# EasyEDA Pro project ProProject_485接口闭环步进电机控制器_V11_2025-04-04.epro, board PCB1
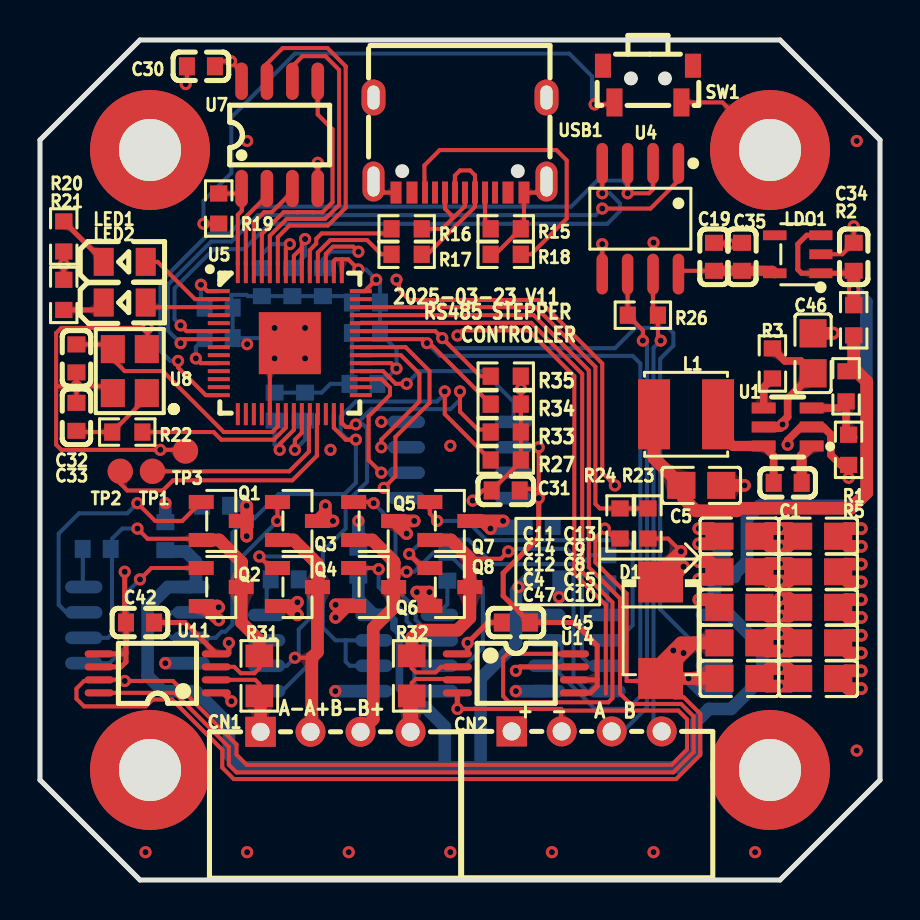
[diagram p1: board, top side]
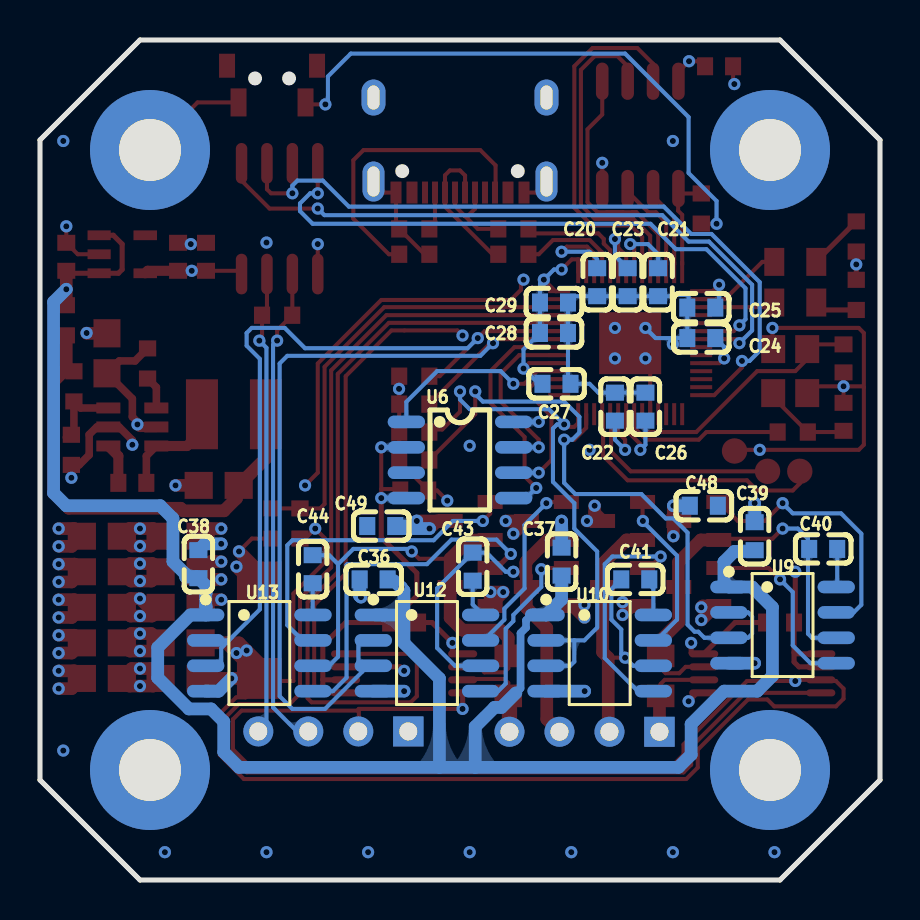
[diagram p2: board, bottom side, seen from below]

Outline 42 x 42 mm; copper layers: Top Layer, Inner1, Inner2, Bottom Layer. Coordinates in mm from the lower left corner of the outline.
Outline path: 0,37 0,5 5,0 37,0 42,5 42,37 37,42 5,42 0,37
Stack: Top Layer 0.035mm 外层铜厚1oz / Dielectric1 0.2104mm 7628 RC49% 8.6mil / Inner1 0.0152mm 内层铜厚 / Dielectric2 1.065mm 1.1mm H/HOZ 含铜 / Inner2 0.0152mm 内层铜厚 / Dielectric3 0.2104mm 7628 RC49% 8.6mil / Bottom Layer 0.035mm 外层铜厚1oz

## Design rules (mm)
template: 自定义配置
spacing copperThickness1oz (default): track to track 0.127, other pairs 0.152 to 0.3
spacing copperThickness2oz: track to track 0.203, other pairs 0.152 to 0.3
track width copperThickness1oz (default): min 0.127, default 0.254, max 2.54
track width copperThickness2oz: min 0.203, default 0.254, max 2.54
differential pair differentialPair (default): width min 0.127, default 0.254, max 2.54; gap min 0.152, default 0.152
via viaSize (default): diameter min 0.5, default 0.61, max 10; hole min 0.3, default 0.305, max 6.299
net GND uses copperRegion_AB
net A+ uses copperRegion_AB
net A- uses copperRegion_AB
net B- uses copperRegion_AB
net B+ uses copperRegion_AB
net A-- uses copperRegion_AB
pour e50 uses copperRegion_AB

## Placement (name value [footprint] x y rotation side)
C1  470nF  [C0603]  37.38 19.86 180 top
C4  22uF  [C0805]  34.97 11.86 0 top
C5  22uF  [C0805]  33.06 19.73 180 top
C8  22uF  [C0805]  38.91 13.63 180 top
C9  22uF  [C0805]  38.91 15.41 180 top
C10  22uF  [C0805]  38.91 10.08 180 top
C11  22uF  [C0805]  34.97 17.19 0 top
C12  22uF  [C0805]  34.97 13.63 0 top
C13  22uF  [C0805]  38.91 17.19 180 top
C14  22uF  [C0805]  34.97 15.41 0 top
C15  22uF  [C0805]  38.91 11.86 180 top
C19  100nF  [C0603]  33.7 31.16 90 top
C20  1uF  [C0603]  14.14 29.89 90 bottom
C21  100nF  [C0603]  11.09 29.89 90 bottom
C22  100nF  [C0603]  13.25 23.67 270 bottom
C23  100nF  [C0603]  12.62 29.89 90 bottom
C24  100nF  [C0603]  8.94 27.1 180 bottom
C25  100nF  [C0603]  8.94 28.62 180 bottom
C26  100nF  [C0603]  11.73 23.67 270 bottom
C27  100nF  [C0603]  16.17 24.81 0 bottom
C28  100nF  [C0603]  16.3 27.35 0 bottom
C29  1uF  [C0603]  16.3 28.87 0 bottom
C30  100nF  [C0603]  8.05 40.69 0 top
C31  100nF  [C0603]  23.29 19.48 180 top
C32  12pF  [C0603]  1.82 26.08 90 top
C33  12pF  [C0603]  1.82 23.16 270 top
C34  1uF  [C0603]  40.69 31.16 270 top
C35  1uF  [C0603]  35.1 31.16 270 top
C36  100nF  [C0603]  25.32 15.03 180 bottom
C37  100nF  [C0603]  15.92 15.92 270 bottom
C38  100nF  [C0603]  34.08 15.79 270 bottom
C39  100nF  [C0603]  6.27 17.19 270 bottom
C40  1uF  [C0603]  2.84 16.56 180 bottom
C41  1uF  [C0603]  12.24 15.03 180 bottom
C42  100nF  [C0603]  5 12.87 180 top
C43  1uF  [C0603]  20.37 15.67 270 bottom
C44  1uF  [C0603]  28.37 15.54 270 bottom
C45  100nF  [C0603]  23.79 12.87 0 top
C46  22uF  [C0805]  38.65 26.33 270 top
C47  22uF  [C0805]  34.97 10.08 0 top
C48  100nF  [C0603]  8.81 18.71 0 bottom
C49  100nF  [C0603]  24.94 17.7 180 bottom
CN1  ZX-XH2.54-4PWZ  [conn-th_4p-p2.50_zx-xh2.54-4pwz]  14.78 7.41 0 top
CN2  ZX-XH2.54-4PWZ  [CONN-TH_4P-P2.50_ZX-XH2.54-4PWZ]  27.34 7.43 0 top
D1  SMBJ30A  [SMB_L4.6-W3.6-LS5.4-RD]  31.03 12.49 270 top
L1  22uH  [IND-SMD_L4.0-W4.0]  32.3 23.29 180 top
LDO1  ME6211C33M5G-N  [SOT-23-5_L3.0-W1.7-P0.95-LS2.8-BL]  37.89 31.29 90 top
LED1  NCD0805R1  [LED0805-R-RD]  4.24 30.91 0 top
LED2  NCD0805R1  [LED0805-R-RD]  4.24 28.87 0 top
NOREF  -  [Pad_e105]  36.5 36.5 0 top
NOREF#2  -  [Pad_e104]  5.5 36.5 0 top
NOREF#3  -  [Pad_e108]  36.5 5.5 0 top
NOREF#4  -  [Pad_e107]  5.5 5.5 0 top
Q1  SI2318A  [SOT-23-3_L2.9-W1.3-P1.90-LS2.4-BR]  9.06 17.95 180 top
Q2  SI2318A  [SOT-23-3_L2.9-W1.3-P1.90-LS2.4-BR]  9.06 14.65 180 top
Q3  SI2318A  [SOT-23-3_L2.9-W1.3-P1.90-LS2.4-BR]  12.87 17.95 180 top
Q4  SI2318A  [SOT-23-3_L2.9-W1.3-P1.90-LS2.4-BR]  12.87 14.65 180 top
Q5  SI2318A  [SOT-23-3_L2.9-W1.3-P1.90-LS2.4-BR]  16.68 17.95 180 top
Q6  SI2318A  [SOT-23-3_L2.9-W1.3-P1.90-LS2.4-BR]  16.68 14.65 180 top
Q7  SI2318A  [SOT-23-3_L2.9-W1.3-P1.90-LS2.4-BR]  20.49 17.95 180 top
Q8  SI2318A  [SOT-23-3_L2.9-W1.3-P1.90-LS2.4-BR]  20.49 14.65 180 top
R1  43kΩ  [R0603]  40.3 24.68 90 top
R2  0Ω  [R0603]  40.69 27.98 90 top
R3  10kΩ  [R0603]  36.62 25.83 90 top
R5  8.2kΩ  [R0603]  40.43 21.51 90 top
R15  5.1kΩ  [R0603]  23.29 32.56 180 top
R16  27Ω  [R0603]  18.33 32.56 0 top
R17  27Ω  [R0603]  18.33 31.29 0 top
R18  5.1kΩ  [R0603]  23.29 31.29 0 top
R19  1k  [R0603]  8.94 33.57 90 top
R20  5.1kΩ  [R0603]  1.19 32.18 270 top
R21  5.1kΩ  [R0603]  1.19 29.25 90 top
R22  1k  [R0603]  4.36 22.4 0 top
R23  47kΩ  [R0603]  30.4 17.83 270 top
R24  5.1kΩ  [R0603]  29 17.83 90 top
R26  120Ω  [R0603]  30.14 28.24 0 top
R27  2.2kΩ  [R0603]  23.29 21 180 top
R31  10mΩ  [R0805]  10.97 10.2 270 top
R32  10mΩ  [R0805]  18.59 10.2 270 top
R33  2.2kΩ  [R0603]  23.29 22.4 180 top
R34  2.2kΩ  [R0603]  23.29 23.79 180 top
R35  2.2kΩ  [R0603]  23.29 25.19 180 top
SW1  TS24CA 250gf 013  [SW-SMD_L4.7-W3.5-P3.35-EH]  30.4 39.8 0 top
TP1  -  [tp]  5.62 20.43 0 top
TP2  -  [tp]  4.01 20.43 0 top
TP3  -  [tp]  7.27 21.45 90 top
U1  SGM61410XN6G/TR  [TSOT-23-6_L2.9-W1.6-P0.95-LS2.8-BL]  37.38 22.65 90 top
U4  SP3485EEN(UMW)  [SOP-8_L5.0-W4.0-P1.27-LS6.0-BL]  30.02 33.06 180 top
U5  RP2040  [LQFN-56_L7.0-W7.0-P0.4-EP]  12.49 26.84 0 top
U6  MT6816CT-STD  [SOP-8_L4.9-W3.9-P1.27-LS6.0-BL]  21 21 270 bottom
U7  W25Q16JVSNIQ  [SOP-8_L4.9-W3.9-P1.27-LS6.0-BL]  11.98 37.26 0 top
U8  12MHz  [CRYSTAL-SMD_4P-L3.2-W2.5-BL_SIT8008BI]  4.49 25.44 90 top
U9  EG3013S  [SOP-8_L4.9-W3.9-P1.27-LS6.0-BL-1]  4.87 12.75 270 bottom
U10  EG3013S  [SOP-8_L4.9-W3.9-P1.27-LS6.0-BL-1]  14.01 11.35 270 bottom
U11  INA240A2PWR  [TSSOP-8_L4.4-W3.0-P0.65-LS6.4-BL]  5.89 10.33 90 top
U12  EG3013S  [SOP-8_L4.9-W3.9-P1.27-LS6.0-BL-1]  22.65 11.35 270 bottom
U13  EG3013S  [SOP-8_L4.9-W3.9-P1.27-LS6.0-BL-1]  31.03 11.35 270 bottom
U14  INA240A2PWR  [TSSOP-8_L4.4-W3.0-P0.65-LS6.4-BL]  23.79 10.33 270 top
USB1  TYPE-C 16PIN 2MD(073)  [USB-C-SMD_TYPE-C-6PIN-2MD-073]  21 36.75 180 top

## Footprints (pads in the part's own frame, mm; a bottom-side part is the same pattern mirrored in y, then rotated)
C0603
  rect 0.8x0.9 smd: 1(-0.7,0) 2(0.7,0)
C0805
  rect 1.41x1.35 smd: 1(-1,0) 2(1,0)
conn-th_4p-p2.50_zx-xh2.54-4pwz
  rect 1.524x1.5 hole 0.9: 1(-3.75,0)
  round 1.5 hole 0.9: 2(-1.25,0) 3(1.25,0) 4(3.75,0)
CONN-TH_4P-P2.50_ZX-XH2.54-4PWZ
  rect 1.524x1.5 hole 0.9: 1(-3.75,0)
  round 1.5 hole 0.9: 2(-1.25,0) 3(1.25,0) 4(3.75,0)
CRYSTAL-SMD_4P-L3.2-W2.5-BL_SIT8008BI
  rect 1.4x1.2 smd: 1(-1.1,-0.85) 2(1.1,-0.85) 3(1.1,0.85) 4(-1.1,0.85)
IND-SMD_L4.0-W4.0
  rect 1.6x3.5 smd: 1(-1.6,0) 2(1.6,0)
LED0805-R-RD
  rect 1x1.399 smd: 1(1.05,0) 2(-1.05,0)
LQFN-56_L7.0-W7.0-P0.4-EP
  rect 1.1x0.2 smd: 1(-3.55,2.6) 2(-3.55,2.2) 3(-3.55,1.8) 4(-3.55,1.4) 5(-3.55,1) 6(-3.55,0.6) 7(-3.55,0.2) 8(-3.55,-0.2) 9(-3.55,-0.6) 10(-3.55,-1) 11(-3.55,-1.4) 12(-3.55,-1.8) 13(-3.55,-2.2) 14(-3.55,-2.6) 29(3.55,-2.6) 30(3.55,-2.2) 31(3.55,-1.8) 32(3.55,-1.4) 33(3.55,-1) 34(3.55,-0.6) 35(3.55,-0.2) 36(3.55,0.2) 37(3.55,0.6) 38(3.55,1) 39(3.55,1.4) 40(3.55,1.8) 41(3.55,2.2) 42(3.55,2.6)
  rect 0.2x1.1 smd: 15(-2.6,-3.55) 16(-2.2,-3.55) 17(-1.8,-3.55) 18(-1.4,-3.55) 19(-1,-3.55) 20(-0.6,-3.55) 21(-0.2,-3.55) 22(0.2,-3.55) 23(0.6,-3.55) 24(1,-3.55) 25(1.4,-3.55) 26(1.8,-3.55) 27(2.2,-3.55) 28(2.6,-3.55) 43(2.6,3.55) 44(2.2,3.55) 45(1.8,3.55) 46(1.4,3.55) 47(1,3.55) 48(0.6,3.55) 49(0.2,3.55) 50(-0.2,3.55) 51(-0.6,3.55) 52(-1,3.55) 53(-1.4,3.55) 54(-1.8,3.55) 55(-2.2,3.55) 56(-2.6,3.55)
  rect 3.1x3.1 smd: 57(0,0)
Pad_e104
  round 6 hole 3.1: 58(0,0)
Pad_e105
  round 6 hole 3.1: 59(0,0)
Pad_e107
  round 6 hole 3.1: 60(0,0)
Pad_e108
  round 6 hole 3.1: 61(0,0)
R0603
  rect 0.806x0.864 smd: 1(-0.753,0) 2(0.753,0)
R0805
  rect 1.133x1.377 smd: 1(-1,0) 2(1,0)
SMB_L4.6-W3.6-LS5.4-RD
  rect 2.047x2.241 smd: 1(-2.413,0) 2(2.413,0)
SOP-8_L4.9-W3.9-P1.27-LS6.0-BL
  oval 0.63x1.865 smd: 1(-1.905,-2.683) 2(-0.635,-2.683) 3(0.635,-2.683) 4(1.905,-2.683) 5(1.905,2.683) 6(0.635,2.683) 7(-0.635,2.683) 8(-1.905,2.683)
SOP-8_L4.9-W3.9-P1.27-LS6.0-BL-1
  oval 0.63x1.865 smd: 1(-1.905,-2.683) 2(-0.635,-2.683) 3(0.635,-2.683) 4(1.905,-2.683) 5(1.905,2.683) 6(0.635,2.683) 7(-0.635,2.683) 8(-1.905,2.683)
SOP-8_L5.0-W4.0-P1.27-LS6.0-BL
  oval 0.574x2.035 smd: 1(-1.905,-2.768) 2(-0.635,-2.768) 3(0.635,-2.768) 4(1.905,-2.768) 5(1.905,2.768) 6(0.635,2.768) 7(-0.635,2.768) 8(-1.905,2.768)
SOT-23-3_L2.9-W1.3-P1.90-LS2.4-BR
  rect 1.25x0.7 smd: 1(1,-0.95) 2(1,0.95) 3(-1,0)
SOT-23-5_L3.0-W1.7-P0.95-LS2.8-BL
  rect 0.49x1.157 smd: 1(-0.95,-1.153) 2(0,-1.153) 3(0.95,-1.153)
  rect 0.49x1.175 smd: 4(0.95,1.153) 5(-0.95,1.153)
SW-SMD_L4.7-W3.5-P3.35-EH
  rect 0.8x1.4 smd: 1(-1.675,-0.917) 2(1.675,-0.917)
  rect 0.8x1.2 smd: 3(-2.25,0.917) 4(2.25,0.917)
tp
  round 1.27 smd: 1(0,0)
TSOT-23-6_L2.9-W1.6-P0.95-LS2.8-BL
  rect 0.55x1.2 smd: 1(-0.95,-1.2) 2(0,-1.2) 3(0.95,-1.2) 4(0.95,1.2) 5(0,1.2) 6(-0.95,1.2)
TSSOP-8_L4.4-W3.0-P0.65-LS6.4-BL
  oval 0.353x1.454 smd: 1(-0.975,-2.927) 2(-0.325,-2.927) 3(0.325,-2.927) 4(0.975,-2.927) 5(0.975,2.927) 6(0.325,2.927) 7(-0.325,2.927) 8(-0.975,2.927)
USB-C-SMD_TYPE-C-6PIN-2MD-073
  rect 0.55x1.1 smd: 1(-3.2,2.375) 2(-2.4,2.375) 11(2.4,2.375) 12(3.2,2.375)
  rect 0.3x1.1 smd: 3(-1.75,2.375) 4(-1.25,2.375) 5(-0.75,2.375) 6(-0.25,2.375) 7(0.25,2.375) 8(0.75,2.375) 9(1.25,2.375) 10(1.75,2.375)
  oval 1.1x2 hole 0.6x1.5: 13(-4.325,1.825) 14(4.325,1.825)
  oval 1.2x1.8 hole 0.6x1.2: 13(-4.325,-2.375) 14(4.325,-2.375)

## Nets
As in the schematic, except:
GND: C4.1 C5.1 C8.1 C9.1 C10.1 C11.1 C12.1 C13.1 C14.1 C15.1 C19.2 C20.1 C21.1 C22.1 C23.1 C24.1 C25.1 C26.1 C27.1 C28.1 C29.1 C30.1 C31.2 C32.1 C33.1 C34.1 C35.1 C36.1 C37.1 C38.1 C39.1 C42.1 C45.1 C46.1 C47.1 C48.1 C49.1 CN2.2 D1.2 LDO1.2 NOREF.59 NOREF#2.58 NOREF#3.61 NOREF#4.60 Q2.2 Q4.2 Q6.2 Q8.2 R5.1 R15.1 R18.1 R20.2 R21.2 R24.1 R27.1 R33.1 R34.1 R35.1 SW1.2 TP3.1 U1.2 U4.5 U5.19 U5.57 U6.8 U7.4 U8.2 U8.4 U9.4 U10.4 U11.1 U11.4 U11.7 U12.4 U13.4 U14.1 U14.4 U14.7 USB1.1 USB1.12 USB1.13 USB1.14

Pads without a net: LDO1 4; SW1 3 4; U5 4 5 8 9 11 12 13 15 16 17 18 26 29 30 41; U6 3; USB1 2 3 9 11

## Via types
v1: diameter 0.61, hole 0.305, Top Layer to Bottom Layer, 146 vias

## Routing (per net, layer and track width the routed paths; a pad name or vN(x,y) marks a point on that pad's centre or on a via; arc(x,y) is an arc through that point)
5V: length 103.9
  Top Layer w0.254: C34.2 40.56,30.34 LDO1.1 38.08,30.34 37.89,30.53 37.89,31.8 38.33,32.24 39.04,32.24
  Top Layer w0.635: C34.2 v1(40.69,29.54) R2.2
  Bottom Layer w0.381: 17.43,13.25 17.7,12.99 17.7,12.62 17.97,12.34 17.97,9.58 18.21,9.35
  Bottom Layer w0.635: U13.1 33.7,13.27 33.7,13.68 33.71,13.69 33.71,14.34 33.7,14.35 33.7,14.71 C38.2 34.15,15.16 34.72,15.16 34.72,15.28 35.35,15.92 35.35,18.08 35.99,18.71 40.69,18.71 41.32,19.35 41.32,28.9 v1(40.69,29.54) ; U13.1 33.59,13.25 ; U13.1 34.48,13.25 36.11,11.62 36.11,10.11 34.55,8.55 33.45,8.55 32.81,7.92 32.81,6.39 32.05,5.63 22.03,5.63 ; 17.43,13.25 U10.1 15.92,14.03 C37.2 ; 6.27,16.43 7.28,16.43 7.8,15.91 7.8,14.9 U9.1 6.4,14.65 5.38,13.63 5.38,10.2 6.14,9.44 7.79,9.44 9.44,7.79 9.44,6.27 10.08,5.63 20.24,5.63 ; 23.8,13.19 23.8,14.47 24.3,14.97 ; 23.8,13.19 23.8,11.85 22.03,10.08 22.03,5.63 ; 23.8,13.19 23.87,13.25 25.21,13.25 ; 22.03,5.63 20.24,5.63 ; 20.24,5.63 20.24,7.67 19.27,8.63 18.93,8.63 18.21,9.35
  vias: v1(23.92,14.65)
5V_DCDC: length 22.7
  Top Layer w0.635: L1.2 30.7,21.09 C5.2 32.18,19.62 32.18,19.08 32.8,18.46 34.84,18.46 34.97,18.59 40.56,18.59 41.33,19.36 41.33,24.92 40.69,25.57 R2.1
24V: length 46.8
  Top Layer w0.203: R23.2 31.41,17.07 v1(32.05,16.43)
  Top Layer w0.381: v1(37.13,22.78) 37.13,22.91 37.38,23.16 37.38,24.06 C46.2 38.03,25.95 37.25,25.95 R3.2
  Top Layer w0.508: U1.5 37,22.65 v1(37.13,22.78)
  Top Layer w0.635: v1(18.71,17.95) Q5.3 17.7,17.95 v1(18.33,17.32) ; 30.78,14.9 31.41,14.9 v1(32.18,15.67) ; 30.78,14.9 30.53,14.9 ; 30.78,14.9 30.78,15.16 v1(32.05,16.43) ; v1(10.33,18.71) v1(10.33,17.19) ; v1(23.16,17.95) 22.14,17.95 ; 22.14,17.95 v1(22.52,17.57) ; 22.14,17.95 Q7.3 ; v1(14.27,18.71) 14.27,18.35 Q3.3 v1(14.65,17.95) ; 37.41,10.57 C10.2 37.53,9.7 v1(37,9.7) 36.35,9.7 C47.2 36.46,10.57 v1(37,10.57) 37.41,10.57 ; v1(37,16.7) 36.46,16.7 C11.2 36.35,17.57 v1(37,17.57) 37.53,17.57 C13.2 37.41,16.7 v1(37,16.7) ; 37.44,14.95 C9.2 37.5,15.82 v1(37,15.82) 36.38,15.82 C14.2 36.44,14.95 v1(37,14.95) 37.44,14.95 ; 37.47,14.07 C8.2 37.47,13.2 v1(37,13.2) 36.41,13.2 C12.2 36.56,13.63 v1(37,14.07) 37.47,14.07 ; v1(37,12.32) 37.44,12.32 C15.2 37.5,11.45 v1(37,11.45) 36.38,11.45 C4.2 36.44,12.32 v1(37,12.32)
  Bottom Layer w0.635: v1(22.52,17.57) 24.11,17.57 24.24,17.7 23.41,17.7 v1(23.16,17.95) ; v1(10.33,18.71) C48.2
GND: length 284.1
  Top Layer w0.203: C30.1 7.35,39.86 v1(7.28,39.8) ; 1.82,24.68 0.85,24.68 0.81,24.64 ; 0.81,24.64 0.81,21.76 1.06,21.51 v1(6.01,21.51) 6.71,21.51 7.15,21.07 ; 0.81,24.64 0.81,27.35 1.06,27.6 v1(5.38,27.6) 5.38,26.58 U8.2 ; v1(20.87,27.22) 21.13,27.48 24.43,27.48 26.72,25.19 26.72,15.32 28.29,13.75 28.29,9.32 ; R18.1 22.77,31.29 R15.1 24.2,32.72 USB1.1 24.78,34.37 USB1.13 ; v1(1.82,24.68) 3.3,24.68 U8.4 ; v1(1.82,24.68) C33.1 ; v1(1.82,24.68) C32.1 ; C19.2 C35.1 ; v1(13.89,35.86) U7.4 ; 26.06,8.55 v1(20.87,8.55) ; 26.06,8.55 26.06,7.46 CN2.2 ; 26.06,8.55 26.14,8.47 31.92,8.47 32.35,8.04 32.35,6.53 31.58,5.76 10.33,5.76 9.82,6.27 9.82,6.78 6.65,9.95 v1(4.24,9.95) 4.18,10.01 2.96,10.01 2.9,9.95 2.2,9.95 1.82,9.57 1.82,9.06 2.2,8.68 5.29,8.68 5.63,9.03 6.6,9.03 9.11,6.51 9.11,5.62 9.69,5.05 31.81,5.05 33.01,6.26 33.01,8.31 32.19,9.13 31.73,9.13 30.91,9.95 ; 30.91,9.95 D1.2 ; 30.91,9.95 29.33,9.95 29.33,14.32 27.77,15.88 27.77,17.1 v1(28.24,17.57) 28.74,17.07 R24.1 ; LDO1.2 40.11,31.29 C34.1 v1(40.69,32.68) ; U5.57 v1(11.73,26.08) 11.49,25.84 U5.19 ; v1(28.75,19.73) 28.11,20.36 28.11,25.83 24.94,29 18.46,29 17.95,29.51 17.95,29.89 v1(17.82,30.02) ; R35.1 24.05,25.18 v1(24.05,24.56) 24.05,23.8 R34.1 R33.1 R27.1 24.04,20.93 C31.2 22.14,19.48 v1(21.63,18.97) ; SW1.2 34.12,38.88 NOREF.59 ; USB1.14 17.22,34.37 USB1.12 ; U4.5 v1(28.11,31.8)
  Top Layer w0.254: C42.1 7.25,12.87 8.81,11.31 9.4,11.31 9.44,11.35 v1(9.44,11.86) ; C45.1 22.4,12.87 v1(21.38,11.86) 21.38,11.31 20.87,11.31 ; v1(23.79,10.46) 23.99,10.66 U14.7 ; U11.1 9.15,9.36 v1(9.57,8.94) ; v1(20.87,8.55) 20.87,8.56 U14.4 ; R20.2 v1(1.19,30.78) R21.2
  Top Layer w0.381: v1(40.43,20.11) R5.1 40.04,20.75 39.54,21.25 39.54,22.27 39.16,22.65 U1.2 38.04,22.65 37.38,21.99 v1(37.38,21.76)
  Top Layer w0.635: v1(32.94,17.57) 33.59,17.57 C11.1 33.59,16.81 v1(32.94,16.81) ; v1(41.07,14.9) 40.41,14.9 C9.1 40.29,15.79 v1(41.07,15.79) ; 32.68,11.86 32.05,11.86 v1(31.67,11.47) 30.53,10.33 30.53,10.08 30.91,10.08 v1(32.18,11.35) 32.68,11.86 ; 32.68,11.86 C4.1 ; v1(14.78,13.76) 15.62,13.76 Q6.2 15.35,13.7 v1(14.78,13.13) ; v1(32.94,14.02) 33.59,14.02 C12.1 ; v1(8.94,13) 8.23,13.7 ; 8.23,13.7 8.87,13.7 v1(8.94,13.63) ; 8.23,13.7 Q2.2 ; 19.49,13.75 v1(18.84,14.4) v1(19.48,14.4) 19.49,14.38 19.49,13.75 ; 19.49,13.75 Q8.2 ; v1(41.07,11.35) 40.41,11.35 C15.1 40.29,12.24 v1(41.07,12.24) ; 12.43,13.7 12.68,13.7 v1(12.87,13.89) ; 12.43,13.7 Q4.2 ; 12.43,13.7 v1(12.87,13.25) ; v1(41.07,9.57) 40.41,9.57 C10.1 40.29,10.46 v1(41.07,10.46) ; v1(35.22,19.73) C5.1 ; 31.03,9.95 31.16,10.08 v1(32.43,10.08) C47.1 ; v1(32.94,15.03) 33.59,15.03 C14.1 33.46,15.92 v1(32.94,15.92) ; v1(41.07,13.13) 40.41,13.13 C8.1 40.29,14.02 v1(41.07,14.02) ; v1(41.07,17.57) 40.29,17.57 C13.1 40.41,16.68 v1(41.07,16.68) ; v1(39.67,27.35) 39.65,27.33 C46.1
  Bottom Layer w0.203: C26.1 C22.1 14.08,24.37 14.52,24.81 C27.1 15.6,24.94 C28.1 C29.1 15.28,29.19 C20.1 C23.1 C21.1 10.4,29.19 10.33,29.25 9.57,29.25 9.57,28.69 C25.1 C24.1 11.22,27.1 v1(11.73,27.6)
  Bottom Layer w0.254: v1(17.06,22.91) U6.8
  Bottom Layer w0.635: U9.4 v1(6.27,10.84) ; 34.08,16.49 33.76,16.81 v1(32.94,16.81) ; U12.4 v1(23.79,9.44) ; v1(32.43,10.08) 33.06,9.44 U13.4 ; v1(25.95,14.14) 26.02,14.21 C36.1 ; 6.27,18.02 v1(6.27,18.84) ; v1(15.92,17.95) C37.1 ; v1(14.77,9.44) U10.4
  vias: v1(5.28,1.39) v1(10.36,36.95) v1(10.36,26.79) v1(10.36,1.39) v1(13.25,27.6) v1(13.25,26.08) v1(14.52,21.51) v1(15.44,1.39) v1(20.52,21.71) v1(20.52,1.39) v1(25.6,1.39) v1(30.68,31.87) v1(30.68,1.39) v1(34.46,31.8) v1(35.76,1.39) v1(40.84,36.95) v1(40.84,6.47)
VBUS_SNS: length 22.5
  Top Layer w0.203: 16.04,28.64 24.79,28.64 27.77,25.66 27.77,18.8 27.99,18.58 R24.2 R23.1
1P1V: length 12.2
  Top Layer w0.203: v1(15.92,31.41) 15.67,31.67 14.65,31.67 14.29,31.31 U5.45 ; v1(12.75,21.51) 12.75,22.02 13.09,22.36 U5.23 ; v1(12.49,31.8) 12.29,31.59 12.29,30.77
  Bottom Layer w0.203: v1(15.92,31.41) 14.52,31.41 14.14,31.03 C20.2 ; C22.2 13.25,22.02 v1(12.75,21.51) ; v1(12.49,31.8) 11.6,31.8 11.09,31.29 C21.2
3P3V: length 61.5
  Top Layer w0.203: 12.69,30.77 12.69,31.2 13.05,31.56 13.09,31.52 ; 13.09,31.52 13.09,30.77 ; 13.09,31.52 13.09,31.89 v1(13.25,32.05) ; 16.04,29.44 16.23,29.44 v1(16.81,30.02) ; 15.11,31.03 15.41,31.03 v1(15.92,30.53) ; 15.11,31.03 14.78,31.03 14.69,30.95 U5.44 ; 15.11,31.03 15.09,31.01 U5.43 ; C19.1 32.09,30.46 U4.8 ; v1(17.82,25.57) 17.56,25.84 16.04,25.84 ; U5.1 8.37,29.44 v1(8.05,29.76) ; U7.8 10.08,40.41 v1(9.55,40.94) 9.13,40.94 8.75,40.56 ; v1(24.94,21.64) 24.94,19.55 ; 24.94,19.55 24.06,19.55 C31.1 ; 24.94,19.55 v1(24.94,19.09) ; U5.22 12.69,22.5 11.98,21.8 v1(11.98,21.51) ; U5.10 8.03,25.84 v1(7.79,26.08)
  Top Layer w0.254: 4.3,11.38 4.23,11.31 2.96,11.31 ; 4.3,11.38 C42.2 4.24,12.93 v1(4.24,15.41) ; 4.3,11.38 4.3,10.9 4.05,10.66 U11.6 ; 27.86,10.03 27.86,9.7 27.52,9.36 U14.5 ; 27.86,10.03 27.86,11.73 26.72,12.87 C45.2 23.16,14.21 23.16,15.35 24.94,17.13 v1(24.94,19.09) ; 27.86,10.03 27.84,10.01 26.72,10.01
  Top Layer w0.508: LDO1.5 36.61,30.46 C35.2 v1(34.41,30.46) C19.1
  Bottom Layer w0.203: v1(7.79,26.08) 7.79,26.65 C24.2 ; v1(11.98,21.51) 11.73,21.76 C26.2 ; C27.2 17.06,24.81 v1(17.82,25.57) 17.82,26.53 C28.2 C29.2 17,29.83 v1(16.81,30.02) 16.3,30.53 v1(15.92,30.53) ; C23.2 13.25,31.22 v1(13.25,32.05) ; C25.2 8.05,28.81 v1(8.05,29.76)
  Bottom Layer w0.254: v1(24.94,21.64) U6.2 ; U6.4 v1(24.94,19.09)
485_A: length 24.3
  Top Layer w0.203: v1(30.14,26.97) 30.14,27.49 R26.1 29.38,28.25 U4.6
  Bottom Layer w0.203: v1(30.14,26.97) 30.35,26.77 30.35,8.63 29.15,7.43 CN2.3
485_B: length 23.3
  Top Layer w0.203: v1(31.03,26.97) 30.9,27.1 R26.2 30.65,28.48 U4.7
  Bottom Layer w0.203: CN2.4 30.68,7.84 30.68,26.61 v1(31.03,26.97)
485_EN: length 37.6
  Top Layer w0.203: U4.3 v1(29.38,34.33) 30.45,34.33 30.65,34.54 U4.2 ; v1(6.9,25.95) 6.9,25.63 8.29,24.24 U5.14
  Bottom Layer w0.203: v1(6.9,25.95) 6.52,25.95 6.01,26.46 6.01,29.89 8.43,32.3 9.44,32.3 10.81,33.67 26.56,33.67 27.86,34.97 29.13,34.97 29.38,34.72 v1(29.38,34.33)
A1H: length 8.2
  Top Layer w0.203: v1(11.86,17.95) 11.87,17.97 Q3.1
  Bottom Layer w0.203: U10.7 11.18,11.98 10.15,13.02 10.15,16.21 11.83,17.9 v1(11.86,17.95)
A1L: length 11.9
  Top Layer w0.203: Q4.1 11.54,15.6 v1(10.97,16.17)
  Bottom Layer w0.203: U10.5 12.11,9.44 13.76,11.09 13.76,15.79 13.38,16.17 v1(10.97,16.17)
A2H: length 13.5
  Top Layer w0.203: Q1.1 7.11,17.95 5.76,17.95 v1(4.87,18.84)
  Bottom Layer w0.203: v1(4.87,18.84) 4.36,18.33 1.95,18.33 0.93,17.32 0.93,13.76 1.31,13.38 U9.7
A2L: length 10
  Top Layer w0.203: Q2.1 5.57,15.6 v1(5,15.03)
  Bottom Layer w0.203: 1.55,10.84 3.47,10.84 4.36,11.73 4.36,14.4 v1(5,15.03)
A+: length 17.9
  Top Layer w0.203: v1(12.75,11.11) 13.59,11.11
  Top Layer w0.635: Q3.2 12.68,17 13.89,15.79 13.89,14.67 Q4.3 13.87,11.4 13.59,11.11 13.59,7.47 CN1.2
  Bottom Layer w0.203: C41.1 13.43,14.54 13.43,13.02 12.94,12.53 12.94,11.31 v1(12.75,11.11) 12.34,10.71 U10.6
A-: length 4.7
  Top Layer w0.203: 8.81,10.01 10.76,10.01 10.97,9.8 R31.2
  Top Layer w0.635: R31.2 11.03,9.14 CN1.1
A--: length 22.3
  Top Layer w0.203: R31.1 10.97,10.59 10.72,10.34 10.04,10.34 9.72,10.66 U11.3 ; v1(4.87,17.57) 5.38,17.06 8,17.06 Q1.2
  Top Layer w0.635: Q1.2 8.96,17 10.08,15.88 10.08,14.67 Q2.3 10.06,12.89 10.97,11.98 R31.1
  Bottom Layer w0.203: 1.55,12.11 3.4,12.11 3.6,12.31 3.6,17.06 4.11,17.57 v1(4.87,17.57)
B1H: length 17
  Top Layer w0.203: v1(19.86,17.95) 19.49,18.32 Q7.1
  Bottom Layer w0.203: v1(19.86,17.95) 21.35,17.95 22.32,16.99 29.38,16.99 29.64,16.73 29.64,12.75 28.87,11.98 U13.7
B1L: length 17.9
  Top Layer w0.254: v1(18.46,16.3) 19.16,15.6 Q8.1
  Bottom Layer w0.203: v1(18.46,16.3) 19.18,17.02 21.42,17.02 22.65,15.79 26.63,15.79 26.67,15.75 26.67,10.12 27.35,9.44 U13.5
B2H: length 9.2
  Top Layer w0.203: Q5.1 16.62,18.9 v1(16.68,18.84)
  Bottom Layer w0.203: 19.84,11.98 19.82,11.98 18.78,13.02 18.78,13.57 17.77,14.57 17.77,17.75 v1(16.68,18.84)
B2L: length 9.1
  Top Layer w0.203: v1(16.94,15.54) 16.88,15.6 Q6.1
  Bottom Layer w0.203: U12.5 19.09,9.44 18.71,9.82 18.71,12.57 18.33,12.95 18.33,13.25 16.94,14.65 v1(16.94,15.54)
B+: length 4.8
  Top Layer w0.203: R32.2 18.59,9.85 18.79,10.05 20.82,10.05 20.87,10.01
  Top Layer w0.762: R32.2 18.53,9.14 CN1.4
B++: length 26.3
  Top Layer w0.203: R32.1 18.59,10.59 18.79,10.38 19.78,10.38 20.06,10.66 U14.2 ; 21.49,16.06 23.05,16.06 v1(23.41,16.43)
  Top Layer w0.635: R32.1 18.59,12.11 18.97,12.49 20.87,12.49 21.49,13.11 Q8.3 21.49,16.06 20.55,17 Q7.2
  Bottom Layer w0.203: U13.6 27.54,10.71 27.1,11.16 27.1,15.79 ; 27.1,15.79 27.54,16.24 C44.1 ; 27.1,15.79 26.33,16.56 23.54,16.56 v1(23.41,16.43)
B-: length 23
  Top Layer w0.203: v1(18.33,15.41) 17.91,15.41 17.71,15.22
  Top Layer w0.635: Q5.2 16.62,17 17.68,15.94 17.68,15.89 17.71,15.86 17.71,15.22 17.68,15.19 Q6.3 17.68,13.62 16.66,12.6 16.66,8.05 CN1.3
  Bottom Layer w0.203: 19.84,10.71 21.25,10.71 22.14,11.6 22.14,14.59 C43.1 19.67,16.37 18.71,15.41 v1(18.33,15.41)
FCS: length 5.2
  Top Layer w0.203: 9.89,30.77 9.89,33.26 10.09,33.46 10.09,34.56 U7.1 10.08,34.95 ; 9.89,34.33 R19.2
FSCK: length 15.5
  Top Layer w0.203: 12.62,40.32 12.62,40.69 13.13,41.19 14.27,41.19 14.96,40.51 14.96,33.75 14.26,33.06 12.34,33.06 11.49,32.21 11.49,30.77
IO0: length 12.5
  Top Layer w0.203: 11.09,30.77 11.09,32.3 12.19,33.39 12.37,33.39 12.38,33.39 12.85,33.39 12.86,33.39 13.64,33.39 13.65,33.39 14.12,33.39 14.62,33.89 14.62,37.54 13.89,38.27 13.89,40.32
IO1: length 4.6
  Top Layer w0.203: 11.35,34.95 U7.2 11.35,34.21 10.29,33.15 10.29,30.77
IO2: length 5.2
  Top Layer w0.203: 12.62,34.95 U7.3 12.62,34.42 11.58,33.39 11.2,33.39 10.69,32.88 10.69,30.77
IO3: length 18
  Top Layer w0.203: U7.7 11.35,40.81 12.13,41.6 14.37,41.6 15.28,40.69 15.28,33.61 14.4,32.73 12.47,32.73 11.89,32.14 11.89,30.77
IOUT_A: length 67.6
  Top Layer w0.203: U11.8 6.74,9.36 9.44,6.65 9.44,5.76 9.82,5.38 31.67,5.38 32.68,6.39 32.68,8.17 32.06,8.8 29.52,8.8 29,9.32 29,14.07 27.44,15.63 27.44,25.48 24.68,28.24 16.04,28.24
IOUT_B: length 40.2
  Top Layer w0.203: 26.72,11.31 23.37,11.31 23.16,11.09 23.16,9.19 23.46,8.88 28.42,8.88 28.62,9.09 28.62,13.88 27.11,15.39 27.11,25.3 24.56,27.86 16.06,27.86 16.04,27.84
LED1: length 4.4
  Top Layer w0.203: U5.2 7.75,29.04 5.89,30.91 LED1.1
LED2: length 3.8
  Top Layer w0.203: LED2.1 5.52,28.64 U5.3
MT6816_CS: length 9.8
  Top Layer w0.203: v1(18.33,24.81) 17.78,24.81 17.15,25.44 16.04,25.44
  Bottom Layer w0.203: U6.1 23.68,23.91 22.14,25.44 18.97,25.44 v1(18.33,24.81)
MT6816_MISO: length 7.9
  Top Layer w0.203: 16.04,25.04 17.09,25.04 17.5,24.63 17.5,24.25 16.43,23.18 16.43,21 v1(17.06,20.36)
  Bottom Layer w0.203: v1(17.06,20.36) U6.6
MT6816_MOSI: length 12.1
  Top Layer w0.203: 16.04,26.64 18.28,26.64 19.48,25.44 19.48,23.86 17.77,22.15 17.77,20.18 v1(17.19,19.6)
  Bottom Layer w0.203: v1(17.19,19.6) 17.7,19.09 U6.5
MT6816_SCK: length 9
  Top Layer w0.203: v1(17.06,21.64) 17.06,22.02 18.97,23.92 18.97,25.32 18.04,26.24 16.04,26.24
  Bottom Layer w0.203: v1(17.06,21.64) U6.7
PWM_A1: length 27.2
  Top Layer w0.203: 15.8,22.65 15.29,22.65 15.09,22.85 U5.28 ; R33.2 22.41,22.52 21.89,22.52 21,23.41 v1(21,24.43)
  Bottom Layer w0.203: 15.28,11.98 14.78,11.98 14.14,12.62 14.14,16.43 15.28,17.57 15.28,18.84 16.35,19.91 16.35,22.58 16.15,22.78 v1(15.79,22.78) 16.56,23.54 20.52,23.54 21,24.02 v1(21,24.43) ; 15.28,11.98 U10.2 ; 15.28,11.98 15.28,10.92 15.49,10.71 U10.3
PWM_A2: length 33.4
  Top Layer w0.203: v1(20.24,24.43) 20.24,23.29 R27.2 ; U5.27 14.69,22.61 15.28,22.02 v1(15.79,22.02)
  Bottom Layer w0.203: 20.24,24.3 19.86,23.92 15.79,23.92 15.03,23.16 15.03,22.37 15.39,22.02 v1(15.79,22.02) 15.79,19.86 15.23,19.3 11.93,19.3 10.71,18.08 10.33,18.08 9.62,17.37 9.62,12.77 9.27,12.42 9.08,12.42 8.78,12.11 U9.3 6.6,12.11 6.4,12.31 6.4,13.18 6.6,13.38 U9.2
PWM_B1: length 39.3
  Top Layer w0.203: R35.2 22.02,25.19 v1(20.11,27.1) 19.76,27.45 16.07,27.45
  Bottom Layer w0.203: 32.56,11.98 32.94,11.6 32.94,10.84 33.06,10.71 U13.3 ; 32.56,11.98 31.01,13.53 31.01,26.05 31.67,26.72 31.67,27.35 31.41,27.6 29.76,27.6 28.75,26.59 20.62,26.59 v1(20.11,27.1) ; 32.56,11.98 U13.2
PWM_B2: length 43.7
  Top Layer w0.203: 16.04,27.04 19.15,27.04 v1(19.35,26.84) 19.48,26.84 R34.2
  Bottom Layer w0.203: 25.88,10.71 U12.3 ; 25.88,10.71 26.08,10.92 26.08,11.98 U12.2 ; 25.88,10.71 25.88,10.43 27.75,8.55 29.38,8.55 30.02,9.19 30.02,25.83 29.64,26.21 19.98,26.21 v1(19.35,26.84)
RXD: length 33.7
  Top Layer w0.203: v1(28.11,33.57) 30.53,33.57 31.92,34.97 U4.1 ; v1(7.03,26.84) 7.23,27.04 U5.7
  Bottom Layer w0.203: v1(28.11,33.57) 27.78,33.24 10.89,33.24 9.57,31.92 8.55,31.92 6.4,29.76 6.4,27.48 v1(7.03,26.84)
SWC: length 10.1
  Top Layer w0.203: TP1.1 12.46,20.43 13.44,21.42 13.44,23.25 U5.24
SWD: length 13.4
  Top Layer w0.203: U5.25 13.84,23.25 13.84,21.21 12.62,19.98 6.65,19.98 6.14,19.48 4.36,19.48 4.01,19.83 TP2.1
TXD: length 30.9
  Top Layer w0.203: U4.4 v1(28.11,34.33) ; v1(7.03,27.73) 7.32,27.44 U5.6
  Bottom Layer w0.203: v1(7.03,27.73) 6.72,28.04 6.72,29.58 8.68,31.54 10.21,31.54 11.47,32.81 28.37,32.81 29,33.45 29,33.83 28.49,34.33 v1(28.11,34.33)
USB_DN: length 7.3
  Top Layer w0.203: USB1.7 20.75,34.38 20.75,35.22 21,35.48 21.51,35.48 21.75,35.24 USB1.5 21.75,33.66 19.37,31.29 R17.2
USB_DP: length 4.8
  Top Layer w0.203: 20.75,33.19 21.25,33.7 USB1.6 ; 20.75,33.19 20.11,32.56 R16.2 ; 20.75,33.19 20.62,33.19 20.25,33.56 USB1.8
$1N1406: length 15
  Top Layer w0.203: R18.2 24.56,31.29 26.33,33.06 26.33,35.99 25.83,36.49 19.98,36.49 19.22,35.73 19.22,34.4 USB1.10
$1N1407: length 1.9
  Top Layer w0.203: USB1.4 22.25,32.84 R15.2
$1N1433: length 29
  Top Layer w0.203: R19.1 8.93,32.81 v1(8.17,32.81) ; 28.72,38.88 28.62,38.78 v1(27.73,38.78)
  Bottom Layer w0.203: v1(8.17,32.81) 8.17,33.95 9.57,35.35 9.57,38.14 12.75,41.32 26.46,41.32 27.6,40.18 27.6,38.91 v1(27.73,38.78)
$1N1437: length 5.8
  Top Layer w0.203: 17.71,32.33 14.08,32.33 13.81,32.06 13.81,31.82 13.49,31.5 U5.47
$1N1440: length 5.2
  Top Layer w0.203: R17.1 17.06,31.29 16.35,32 14.51,32 13.89,31.38 U5.46
$1N1441: length 8.3
  Top Layer w0.203: U5.21 12.29,22.62 11.69,22.02 9.06,22.02 8.68,22.4 R22.2
$1N1445: length 4.5
  Top Layer w0.203: U8.1 5.34,24.13 R22.1 1.88,22.4 C33.2
$1N1446: length 12.9
  Top Layer w0.203: U5.20 11.89,22.68 11.6,22.4 9.19,22.4 6.14,25.44 4.24,25.44 3.64,26.04 U8.3 3.41,26.78 C32.2
$1N3757: length 1.7
  Top Layer w0.381: U1.4 36.18,24.63 R3.1
$1N3760: length 5.6
  Top Layer w0.381: 36.68,19.73 36.68,21.2 U1.6
  Top Layer w0.508: U1.6 34.65,21.7 33.9,22.45 L1.1
$1N3761: length 2.2
  Top Layer w0.508: 38.08,19.73 38.08,21.2 U1.1
$1N3763: length 3.8
  Top Layer w0.381: U1.3 39.98,23.6 R1.1 40.3,22.52 40.69,22.13
$1N15393: length 2.9
  Top Layer w0.254: LED1.2 3.19,30.93 R20.1
$1N15394: length 2.2
  Top Layer w0.254: LED2.2 2.81,28.5 R21.1
$1N23169: length 1.9
  Bottom Layer w0.203: C40.2 2.14,14.7 U9.8
$1N23635: length 1.6
  Bottom Layer w0.203: 11.54,14.78 11.33,14.57 U10.8
$1N25067: length 1.9
  Bottom Layer w0.203: 19.84,13.25 20.37,13.78 C43.2
$1N25091: length 1.6
  Bottom Layer w0.203: U13.8 28.37,13.27 C44.2

## Copper pours and planes (outline as drawn; the poured copper is in the pictures)
24V on Inner1: 7.56,23.3 41.74,23.3 41.74,0.26 7.56,0.26
GND on Top Layer: -0.34,42.21 42.34,42.21 42.34,-0.34 -0.34,-0.34
GND on Bottom Layer: -0.34,42.34 42.34,42.34 42.34,-0.21 -0.34,-0.21
GND on Inner2: 0.26,41.74 41.74,41.74 41.74,0.26 0.26,0.26
1P1V on Inner1: 12.15,31.89 16.27,31.89 16.27,21.28 12.15,21.28
3P3V on Inner1: 0.26,41.74 41.74,41.74 41.74,0.26 0.26,0.26
A+ on Top Layer: 12.49,9.39 12.49,6.9 13,6.39 13.89,6.39 14.52,7.03 14.52,16.18 13.13,17.57 11.22,17.57 11.09,17.44 11.09,16.68 11.47,16.3 12.36,16.3 12.36,7.03 12.49,6.9 12.49,9.39
A- on Top Layer: 10.33,9.7 10.33,6.58 10.64,6.27 11.73,6.27 12.24,6.78 12.24,9.44 11.98,9.7
A-- on Top Layer: 7.54,17.57 9.16,17.57 11.01,15.72 11.01,12.83 11.87,11.98 11.87,10.68 10.27,10.68 10.27,11.67 9.32,12.62 9.32,15.53 8.59,16.25 7.46,16.25 7.46,17.49
B+ on Top Layer: 17.39,6.83 17.82,6.39 19.09,6.39 19.48,6.78 19.48,9.73 17.39,9.73
B++ on Top Layer: 18.84,17.44 21.86,17.44 22.65,16.65 22.65,13.76 20.87,11.98 19.41,11.98 19.41,10.73 17.92,10.73 17.92,12.65 18.59,13.25 20.11,13.25 20.5,13.64 20.5,15.77 20.17,16.1 19.04,16.1 18.71,16.43 18.71,17.32
B- on Top Layer: 15.03,6.9 15.54,6.39 16.56,6.39 17.02,6.86 17.02,12.07 18.71,13.77 18.71,15.84 17.09,17.46 15.14,17.46 15.03,17.57 14.78,17.32 14.78,16.56 14.91,16.43 16.68,16.43 16.68,13.49 15.03,11.84

Small or netless copper shapes (teardrops, artwork), in the pictures only: 279 on Top Layer, 150 on Bottom Layer

## Text on the board
Top Silkscreen Layer: A-A+B-B+ | 2025-03-23 V11 | RS485 STEPPER / CONTROLLER | +  -   A  B
